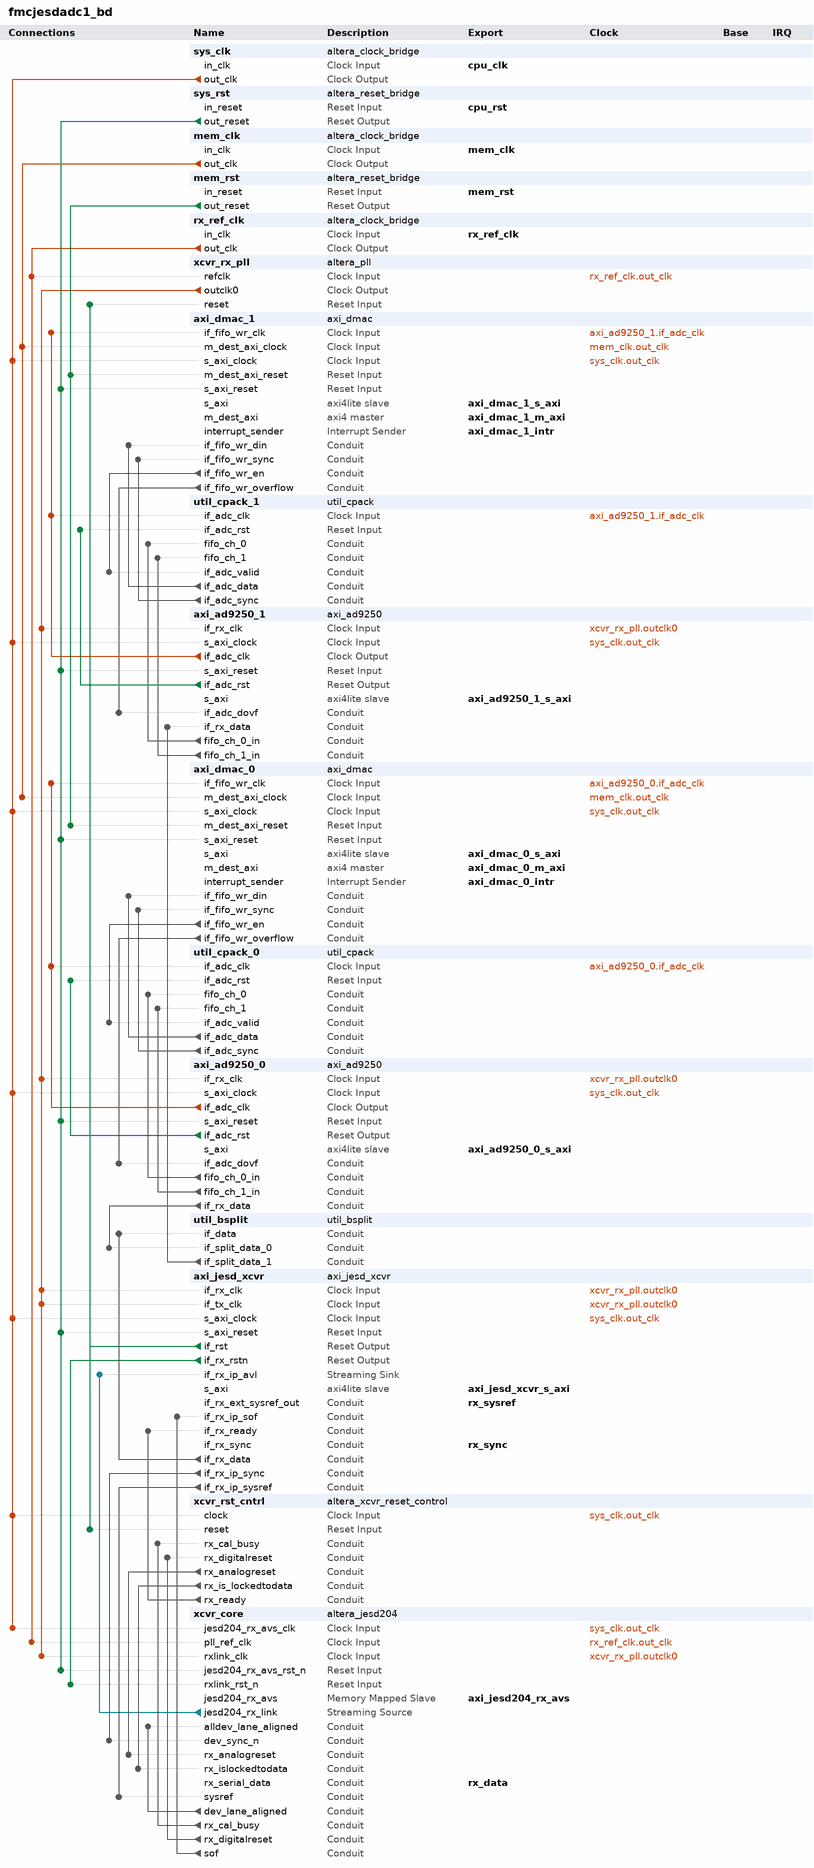
[diagram p0: system contents]
# Platform Designer (Qsys) system fmcjesdadc1_bd, Arria V 5AGTFD7K3F40I3
# Parameters at their usual value, and those the tool derives, are not listed.
package require -exact qsys 15.1
create_system fmcjesdadc1_bd
set_project_property DEVICE_FAMILY {Arria V}
set_project_property DEVICE 5AGTFD7K3F40I3

add_instance sys_clk altera_clock_bridge 15.1
set_instance_parameter_value sys_clk DERIVED_CLOCK_RATE 0
set_instance_parameter_value sys_clk EXPLICIT_CLOCK_RATE 100000000

add_instance sys_rst altera_reset_bridge 15.1
set_instance_parameter_value sys_rst ACTIVE_LOW_RESET 0
set_instance_parameter_value sys_rst SYNCHRONOUS_EDGES none

add_instance mem_clk altera_clock_bridge 15.1
set_instance_parameter_value mem_clk DERIVED_CLOCK_RATE 0
set_instance_parameter_value mem_clk EXPLICIT_CLOCK_RATE 0

add_instance mem_rst altera_reset_bridge 15.1
set_instance_parameter_value mem_rst ACTIVE_LOW_RESET 0
set_instance_parameter_value mem_rst SYNCHRONOUS_EDGES none

add_instance rx_ref_clk altera_clock_bridge 15.1
set_instance_parameter_value rx_ref_clk DERIVED_CLOCK_RATE 0
set_instance_parameter_value rx_ref_clk EXPLICIT_CLOCK_RATE 250000000

add_instance xcvr_rx_pll altera_pll 15.1
set_instance_parameter_value xcvr_rx_pll gui_device_speed_grade 2
set_instance_parameter_value xcvr_rx_pll gui_number_of_clocks 1
set_instance_parameter_value xcvr_rx_pll gui_operation_mode direct
set_instance_parameter_value xcvr_rx_pll gui_output_clock_frequency0 125.0
set_instance_parameter_value xcvr_rx_pll gui_pll_mode {Integer-N PLL}
set_instance_parameter_value xcvr_rx_pll gui_reference_clock_frequency 250.0
set_instance_parameter_value xcvr_rx_pll gui_use_locked true

add_instance axi_dmac_1 axi_dmac 1.0
set_instance_parameter_value axi_dmac_1 ASYNC_CLK_DEST_REQ 1
set_instance_parameter_value axi_dmac_1 ASYNC_CLK_REQ_SRC 1
set_instance_parameter_value axi_dmac_1 ASYNC_CLK_SRC_DEST 1
set_instance_parameter_value axi_dmac_1 AXI_SLICE_DEST 0
set_instance_parameter_value axi_dmac_1 AXI_SLICE_SRC 0
set_instance_parameter_value axi_dmac_1 CYCLIC 0
set_instance_parameter_value axi_dmac_1 DMA_2D_TRANSFER 0
set_instance_parameter_value axi_dmac_1 DMA_DATA_WIDTH_DEST 256
set_instance_parameter_value axi_dmac_1 DMA_DATA_WIDTH_SRC 64
set_instance_parameter_value axi_dmac_1 DMA_LENGTH_WIDTH 24
set_instance_parameter_value axi_dmac_1 DMA_TYPE_DEST 0
set_instance_parameter_value axi_dmac_1 DMA_TYPE_SRC 2
set_instance_parameter_value axi_dmac_1 FIFO_SIZE 64
set_instance_parameter_value axi_dmac_1 ID 0
set_instance_parameter_value axi_dmac_1 SYNC_TRANSFER_START 0

add_instance util_cpack_1 util_cpack 1.0
set_instance_parameter_value util_cpack_1 CHANNEL_DATA_WIDTH 32
set_instance_parameter_value util_cpack_1 NUM_OF_CHANNELS 2

add_instance axi_ad9250_1 axi_ad9250 1.0
set_instance_parameter_value axi_ad9250_1 DEVICE_TYPE 0
set_instance_parameter_value axi_ad9250_1 ID 0

add_instance axi_dmac_0 axi_dmac 1.0
set_instance_parameter_value axi_dmac_0 ASYNC_CLK_DEST_REQ 1
set_instance_parameter_value axi_dmac_0 ASYNC_CLK_REQ_SRC 1
set_instance_parameter_value axi_dmac_0 ASYNC_CLK_SRC_DEST 1
set_instance_parameter_value axi_dmac_0 AXI_SLICE_DEST 0
set_instance_parameter_value axi_dmac_0 AXI_SLICE_SRC 0
set_instance_parameter_value axi_dmac_0 CYCLIC 0
set_instance_parameter_value axi_dmac_0 DMA_2D_TRANSFER 0
set_instance_parameter_value axi_dmac_0 DMA_DATA_WIDTH_DEST 256
set_instance_parameter_value axi_dmac_0 DMA_DATA_WIDTH_SRC 64
set_instance_parameter_value axi_dmac_0 DMA_LENGTH_WIDTH 24
set_instance_parameter_value axi_dmac_0 DMA_TYPE_DEST 0
set_instance_parameter_value axi_dmac_0 DMA_TYPE_SRC 2
set_instance_parameter_value axi_dmac_0 FIFO_SIZE 64
set_instance_parameter_value axi_dmac_0 ID 0
set_instance_parameter_value axi_dmac_0 SYNC_TRANSFER_START 0

add_instance util_cpack_0 util_cpack 1.0
set_instance_parameter_value util_cpack_0 CHANNEL_DATA_WIDTH 32
set_instance_parameter_value util_cpack_0 NUM_OF_CHANNELS 2

add_instance axi_ad9250_0 axi_ad9250 1.0
set_instance_parameter_value axi_ad9250_0 DEVICE_TYPE 0
set_instance_parameter_value axi_ad9250_0 ID 0

add_instance util_bsplit util_bsplit 1.0
set_instance_parameter_value util_bsplit CHANNEL_DATA_WIDTH 64
set_instance_parameter_value util_bsplit NUM_OF_CHANNELS 2

add_instance axi_jesd_xcvr axi_jesd_xcvr 1.0
set_instance_parameter_value axi_jesd_xcvr DEVICE_TYPE 0
set_instance_parameter_value axi_jesd_xcvr ID 0
set_instance_parameter_value axi_jesd_xcvr RX_NUM_OF_LANES 4
set_instance_parameter_value axi_jesd_xcvr TX_NUM_OF_LANES 4

add_instance xcvr_rst_cntrl altera_xcvr_reset_control 15.1
set_instance_parameter_value xcvr_rst_cntrl CHANNELS 4
set_instance_parameter_value xcvr_rst_cntrl RX_PER_CHANNEL 1
set_instance_parameter_value xcvr_rst_cntrl SYS_CLK_IN_MHZ 100
set_instance_parameter_value xcvr_rst_cntrl TX_ENABLE 0
set_instance_parameter_value xcvr_rst_cntrl TX_PLL_ENABLE 0
set_instance_parameter_value xcvr_rst_cntrl T_RX_ANALOGRESET 40
set_instance_parameter_value xcvr_rst_cntrl T_TX_ANALOGRESET 0
set_instance_parameter_value xcvr_rst_cntrl T_TX_DIGITALRESET 20
set_instance_parameter_value xcvr_rst_cntrl device_family {Arria V}
set_instance_parameter_value xcvr_rst_cntrl gui_pll_cal_busy 0
set_instance_parameter_value xcvr_rst_cntrl gui_tx_auto_reset 1

add_instance xcvr_core altera_jesd204 15.1
set_instance_parameter_value xcvr_core ADJCNT 0
set_instance_parameter_value xcvr_core ADJDIR 0
set_instance_parameter_value xcvr_core BID 0
set_instance_parameter_value xcvr_core CF 0
set_instance_parameter_value xcvr_core CS 0
set_instance_parameter_value xcvr_core DATA_PATH RX
set_instance_parameter_value xcvr_core DID 0
set_instance_parameter_value xcvr_core DLB_TEST 0
set_instance_parameter_value xcvr_core ECC_EN 0
set_instance_parameter_value xcvr_core ED_DEV_KIT NONE
set_instance_parameter_value xcvr_core ED_FILESET_SIM false
set_instance_parameter_value xcvr_core ED_FILESET_SYNTH false
set_instance_parameter_value xcvr_core ED_GENERIC_5SERIES No
set_instance_parameter_value xcvr_core ED_GENERIC_A10 No
set_instance_parameter_value xcvr_core ED_HDL_FORMAT_SIM VERILOG
set_instance_parameter_value xcvr_core ED_HDL_FORMAT_SYNTH VERILOG
set_instance_parameter_value xcvr_core GUI_CFG_F 4
set_instance_parameter_value xcvr_core GUI_EN_CFG_F false
set_instance_parameter_value xcvr_core HD 0
set_instance_parameter_value xcvr_core JESDV 1
set_instance_parameter_value xcvr_core K 32
set_instance_parameter_value xcvr_core L 4
set_instance_parameter_value xcvr_core LID0 0
set_instance_parameter_value xcvr_core LID1 1
set_instance_parameter_value xcvr_core LID2 2
set_instance_parameter_value xcvr_core LID3 3
set_instance_parameter_value xcvr_core LID4 4
set_instance_parameter_value xcvr_core LID5 5
set_instance_parameter_value xcvr_core LID6 6
set_instance_parameter_value xcvr_core LID7 7
set_instance_parameter_value xcvr_core M 4
set_instance_parameter_value xcvr_core N 16
set_instance_parameter_value xcvr_core N_PRIME 16
set_instance_parameter_value xcvr_core OPTIMIZE 0
set_instance_parameter_value xcvr_core PCS_CONFIG JESD_PCS_CFG1
set_instance_parameter_value xcvr_core PHADJ 0
set_instance_parameter_value xcvr_core REFCLK_FREQ 250.0
set_instance_parameter_value xcvr_core RES1 0
set_instance_parameter_value xcvr_core RES2 0
set_instance_parameter_value xcvr_core S 1
set_instance_parameter_value xcvr_core SCR 1
set_instance_parameter_value xcvr_core SUBCLASSV 1
set_instance_parameter_value xcvr_core TERMINATE_RECONFIG_EN false
set_instance_parameter_value xcvr_core TEST_COMPONENTS_EN false
set_instance_parameter_value xcvr_core bitrev_en false
set_instance_parameter_value xcvr_core bonded_mode bonded
set_instance_parameter_value xcvr_core lane_rate 5000.0
set_instance_parameter_value xcvr_core part_trait_bd ARRIAVB7
set_instance_parameter_value xcvr_core part_trait_dp 5AGTFD7K3F40I3
set_instance_parameter_value xcvr_core pll_reconfig_enable false
set_instance_parameter_value xcvr_core pll_type CMU
set_instance_parameter_value xcvr_core rcfg_jtag_enable false
set_instance_parameter_value xcvr_core sdc_constraint 1.0
set_instance_parameter_value xcvr_core set_capability_reg_enable false
set_instance_parameter_value xcvr_core set_csr_soft_logic_enable false
set_instance_parameter_value xcvr_core set_prbs_soft_logic_enable false
set_instance_parameter_value xcvr_core set_user_identifier 0
set_instance_parameter_value xcvr_core wrapper_opt base_phy

# connections
add_connection axi_ad9250_0.if_adc_clk axi_dmac_0.if_fifo_wr_clk clock
add_connection axi_ad9250_0.if_adc_clk util_cpack_0.if_adc_clk clock
add_connection axi_ad9250_1.if_adc_clk axi_dmac_1.if_fifo_wr_clk clock
add_connection axi_ad9250_1.if_adc_clk util_cpack_1.if_adc_clk clock
add_connection mem_clk.out_clk axi_dmac_0.m_dest_axi_clock clock
add_connection mem_clk.out_clk axi_dmac_1.m_dest_axi_clock clock
add_connection rx_ref_clk.out_clk xcvr_core.pll_ref_clk clock
add_connection rx_ref_clk.out_clk xcvr_rx_pll.refclk clock
add_connection sys_clk.out_clk axi_ad9250_0.s_axi_clock clock
add_connection sys_clk.out_clk axi_ad9250_1.s_axi_clock clock
add_connection sys_clk.out_clk axi_dmac_0.s_axi_clock clock
add_connection sys_clk.out_clk axi_dmac_1.s_axi_clock clock
add_connection sys_clk.out_clk axi_jesd_xcvr.s_axi_clock clock
add_connection sys_clk.out_clk xcvr_core.jesd204_rx_avs_clk clock
add_connection sys_clk.out_clk xcvr_rst_cntrl.clock clock
add_connection xcvr_rx_pll.outclk0 axi_ad9250_0.if_rx_clk clock
add_connection xcvr_rx_pll.outclk0 axi_ad9250_1.if_rx_clk clock
add_connection xcvr_rx_pll.outclk0 axi_jesd_xcvr.if_rx_clk clock
add_connection xcvr_rx_pll.outclk0 axi_jesd_xcvr.if_tx_clk clock
add_connection xcvr_rx_pll.outclk0 xcvr_core.rxlink_clk clock
add_connection axi_ad9250_0.if_adc_rst util_cpack_0.if_adc_rst reset
add_connection axi_ad9250_1.if_adc_rst util_cpack_1.if_adc_rst reset
add_connection axi_jesd_xcvr.if_rst xcvr_rst_cntrl.reset reset
add_connection axi_jesd_xcvr.if_rst xcvr_rx_pll.reset reset
add_connection axi_jesd_xcvr.if_rx_rstn xcvr_core.rxlink_rst_n reset
add_connection mem_rst.out_reset axi_dmac_0.m_dest_axi_reset reset
add_connection mem_rst.out_reset axi_dmac_1.m_dest_axi_reset reset
add_connection sys_rst.out_reset axi_ad9250_0.s_axi_reset reset
add_connection sys_rst.out_reset axi_ad9250_1.s_axi_reset reset
add_connection sys_rst.out_reset axi_dmac_0.s_axi_reset reset
add_connection sys_rst.out_reset axi_dmac_1.s_axi_reset reset
add_connection sys_rst.out_reset axi_jesd_xcvr.s_axi_reset reset
add_connection sys_rst.out_reset xcvr_core.jesd204_rx_avs_rst_n reset
add_connection xcvr_core.jesd204_rx_link axi_jesd_xcvr.if_rx_ip_avl avalon_streaming
add_connection axi_ad9250_0.fifo_ch_0_in util_cpack_0.fifo_ch_0 conduit
add_connection axi_ad9250_0.fifo_ch_1_in util_cpack_0.fifo_ch_1 conduit
add_connection axi_ad9250_0.if_rx_data util_bsplit.if_split_data_0 conduit
add_connection axi_ad9250_1.fifo_ch_0_in util_cpack_1.fifo_ch_0 conduit
add_connection axi_ad9250_1.fifo_ch_1_in util_cpack_1.fifo_ch_1 conduit
add_connection axi_dmac_0.if_fifo_wr_en util_cpack_0.if_adc_valid conduit
add_connection axi_dmac_0.if_fifo_wr_overflow axi_ad9250_0.if_adc_dovf conduit
add_connection axi_dmac_1.if_fifo_wr_en util_cpack_1.if_adc_valid conduit
add_connection axi_dmac_1.if_fifo_wr_overflow axi_ad9250_1.if_adc_dovf conduit
add_connection axi_jesd_xcvr.if_rx_data util_bsplit.if_data conduit
add_connection axi_jesd_xcvr.if_rx_ip_sync xcvr_core.dev_sync_n conduit
add_connection axi_jesd_xcvr.if_rx_ip_sysref xcvr_core.sysref conduit
add_connection util_bsplit.if_split_data_1 axi_ad9250_1.if_rx_data conduit
add_connection util_cpack_0.if_adc_data axi_dmac_0.if_fifo_wr_din conduit
add_connection util_cpack_0.if_adc_sync axi_dmac_0.if_fifo_wr_sync conduit
add_connection util_cpack_1.if_adc_data axi_dmac_1.if_fifo_wr_din conduit
add_connection util_cpack_1.if_adc_sync axi_dmac_1.if_fifo_wr_sync conduit
add_connection xcvr_core.dev_lane_aligned xcvr_core.alldev_lane_aligned conduit
add_connection xcvr_core.rx_cal_busy xcvr_rst_cntrl.rx_cal_busy conduit
add_connection xcvr_core.rx_digitalreset xcvr_rst_cntrl.rx_digitalreset conduit
add_connection xcvr_core.sof axi_jesd_xcvr.if_rx_ip_sof conduit
add_connection xcvr_rst_cntrl.rx_analogreset xcvr_core.rx_analogreset conduit
add_connection xcvr_rst_cntrl.rx_is_lockedtodata xcvr_core.rx_islockedtodata conduit
add_connection xcvr_rst_cntrl.rx_ready axi_jesd_xcvr.if_rx_ready conduit

# exported interfaces
add_interface axi_ad9250_0_s_axi axi4lite slave
set_interface_property axi_ad9250_0_s_axi EXPORT_OF axi_ad9250_0.s_axi
add_interface axi_ad9250_1_s_axi axi4lite slave
set_interface_property axi_ad9250_1_s_axi EXPORT_OF axi_ad9250_1.s_axi
add_interface axi_dmac_0_intr interrupt sender
set_interface_property axi_dmac_0_intr EXPORT_OF axi_dmac_0.interrupt_sender
add_interface axi_dmac_0_m_axi axi4 master
set_interface_property axi_dmac_0_m_axi EXPORT_OF axi_dmac_0.m_dest_axi
add_interface axi_dmac_0_s_axi axi4lite slave
set_interface_property axi_dmac_0_s_axi EXPORT_OF axi_dmac_0.s_axi
add_interface axi_dmac_1_intr interrupt sender
set_interface_property axi_dmac_1_intr EXPORT_OF axi_dmac_1.interrupt_sender
add_interface axi_dmac_1_m_axi axi4 master
set_interface_property axi_dmac_1_m_axi EXPORT_OF axi_dmac_1.m_dest_axi
add_interface axi_dmac_1_s_axi axi4lite slave
set_interface_property axi_dmac_1_s_axi EXPORT_OF axi_dmac_1.s_axi
add_interface axi_jesd204_rx_avs avalon slave
set_interface_property axi_jesd204_rx_avs EXPORT_OF xcvr_core.jesd204_rx_avs
add_interface axi_jesd_xcvr_s_axi axi4lite slave
set_interface_property axi_jesd_xcvr_s_axi EXPORT_OF axi_jesd_xcvr.s_axi
add_interface cpu_clk clock sink
set_interface_property cpu_clk EXPORT_OF sys_clk.in_clk
add_interface cpu_rst reset sink
set_interface_property cpu_rst EXPORT_OF sys_rst.in_reset
add_interface mem_clk clock sink
set_interface_property mem_clk EXPORT_OF mem_clk.in_clk
add_interface mem_rst reset sink
set_interface_property mem_rst EXPORT_OF mem_rst.in_reset
add_interface rx_data conduit end
set_interface_property rx_data EXPORT_OF xcvr_core.rx_serial_data
add_interface rx_ref_clk clock sink
set_interface_property rx_ref_clk EXPORT_OF rx_ref_clk.in_clk
add_interface rx_sync conduit end
set_interface_property rx_sync EXPORT_OF axi_jesd_xcvr.if_rx_sync
add_interface rx_sysref conduit end
set_interface_property rx_sysref EXPORT_OF axi_jesd_xcvr.if_rx_ext_sysref_out

set_interconnect_requirement {$system} qsys_mm.clockCrossingAdapter FIFO
set_interconnect_requirement {$system} qsys_mm.insertDefaultSlave false
set_interconnect_requirement {$system} qsys_mm.maxAdditionalLatency 2

save_system fmcjesdadc1_bd.qsys
